# EAGLE schematic p20-001 (EAGLE 9.6.2)
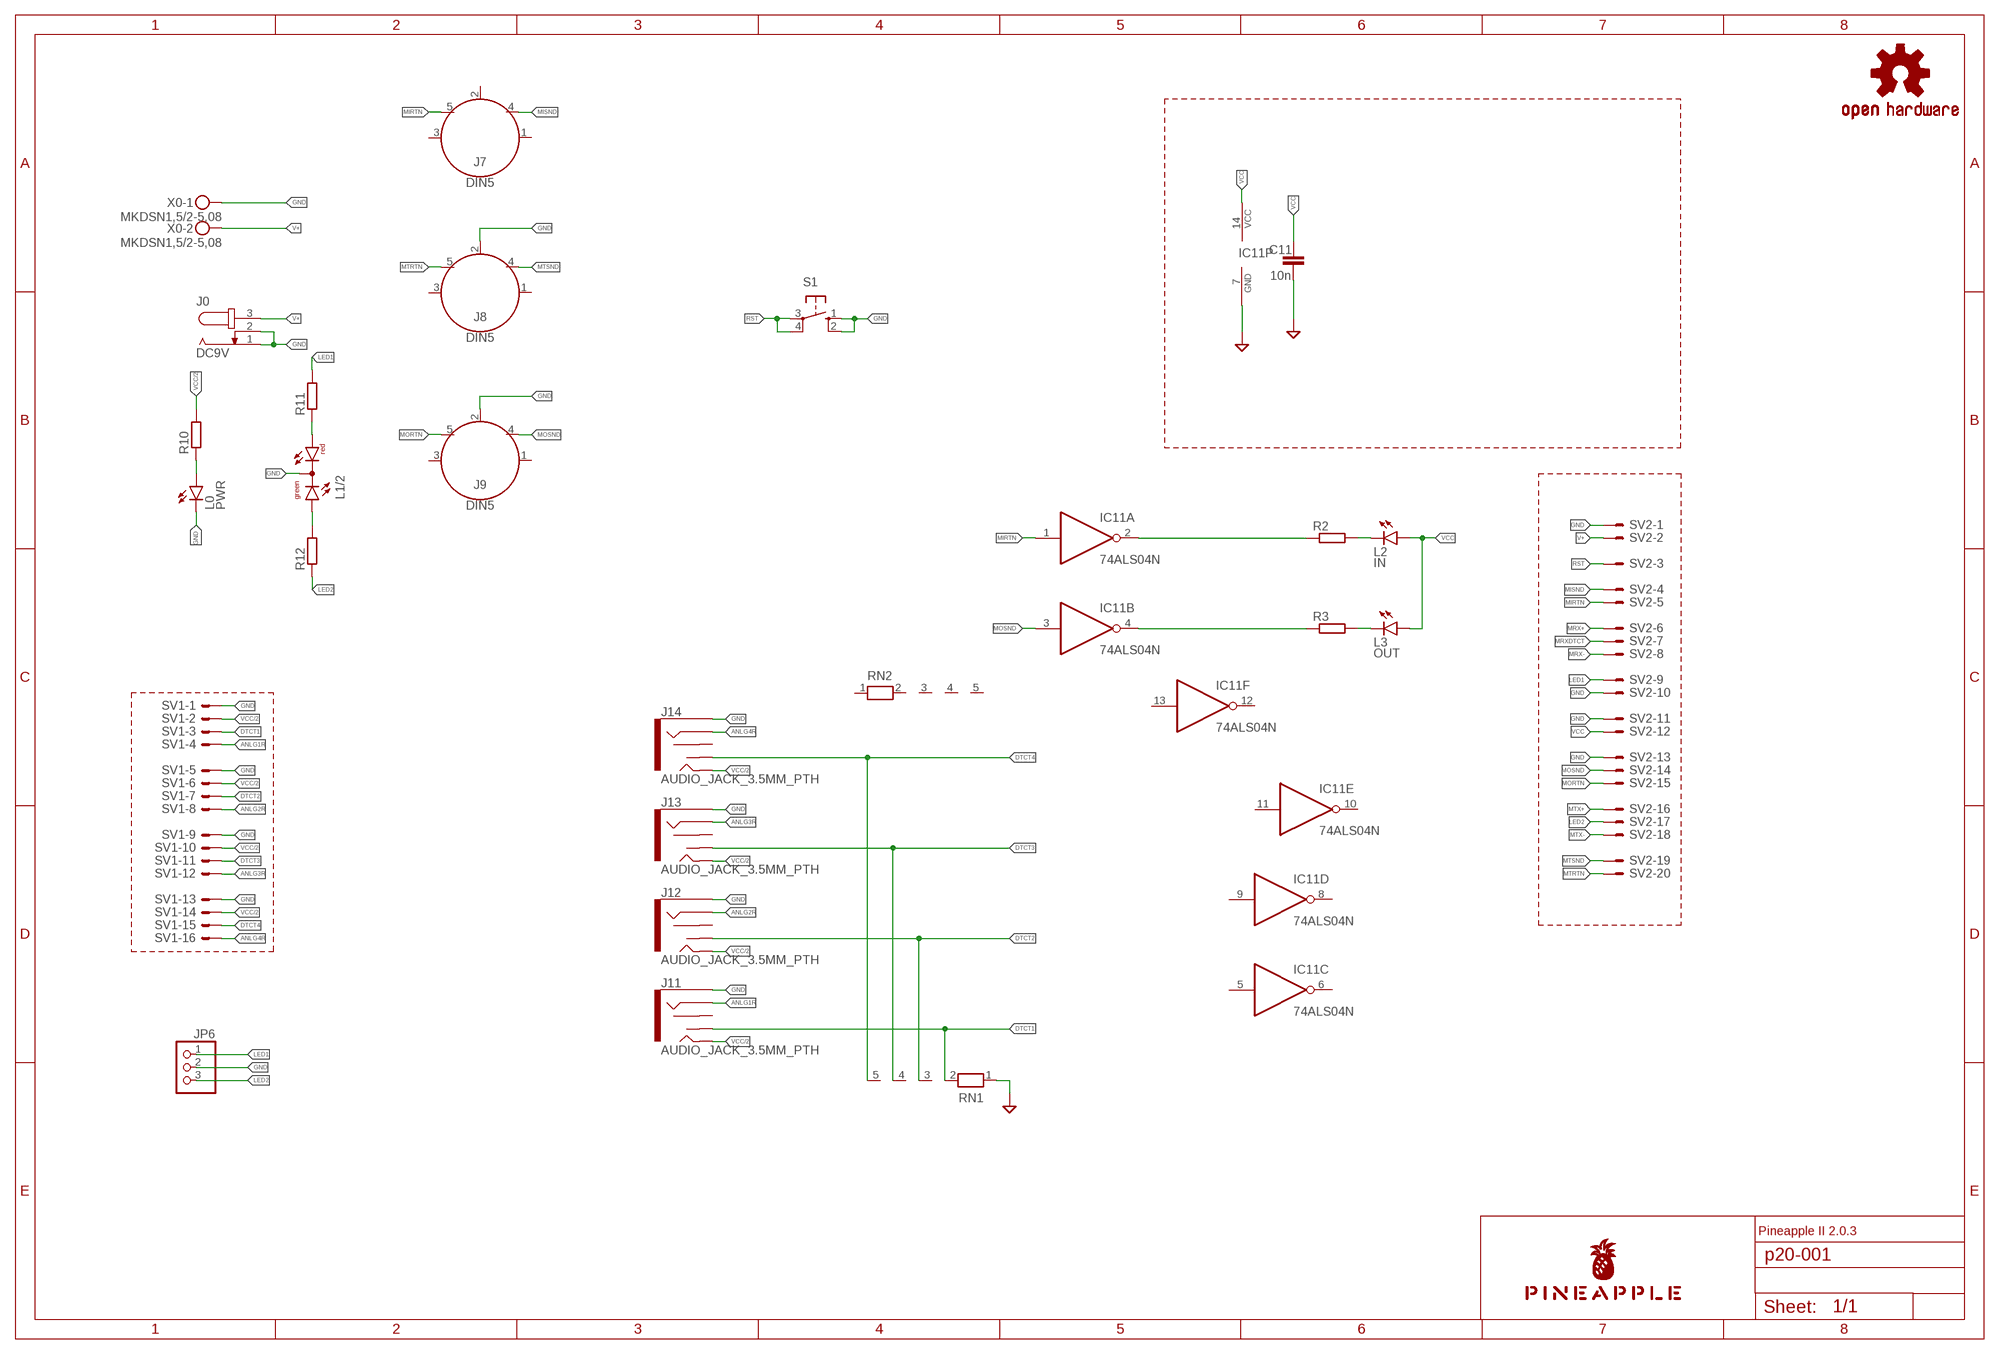
[diagram p0: schematic, sheet 1]

## Parts
C11  10n  C-EU025-024X044  [C025-024X044]
IC11  74ALS04N  [DIL14]
J0  DC9V  JACK-PLUG0  [SPC4077]
J7  DIN5  [DIN5-RA-PTH]
J8  DIN5  [DIN5-RA-PTH]
J9  DIN5  [DIN5-RA-PTH]
J11  AUDIO_JACK_3.5MM_PTH  [AUDIO-JACK]
J12  AUDIO_JACK_3.5MM_PTH  [AUDIO-JACK]
J13  AUDIO_JACK_3.5MM_PTH  [AUDIO-JACK]
J14  AUDIO_JACK_3.5MM_PTH  [AUDIO-JACK]
JP6  PINHD-1X3  [1X03]
L0  PWR  LED3MM  [LED3MM]
L1/2  DUOLED-RG-C  [DUOLED-C-5MM]
L2  IN  LED3MM  [LED3MM]
L3  OUT  LED3MM  [LED3MM]
LOGO1  OSHW-LOGOS-COPPER  [OSHW-LOGO-S_COPPER]
R2  R-EU_0204/5  [0204/5]
R3  R-EU_0204/5  [0204/5]
R10  R-EU_0204/5  [0204/5]
R11  R-EU_0204/5  [0204/5]
R12  R-EU_0204/5  [0204/5]
RN1  RN04  [RN-5]
RN2  RN04  [RN-5]
S1  10-XX  [B3F-10XX]
SV1  ML16LE  [ML16L]
SV2  ML20LE  [ML20L]
U$1  PINEAPPLE450_SILK  [PINEAPPLE450_SILK]
X0  MKDSN1,5/2-5,08  [MKDSN1,5/2-5,08]

## Nets
ANLG1R: J11.RING SV1.4
ANLG2R: J12.RING SV1.8
ANLG3R: J13.RING SV1.12
ANLG4R: J14.RING SV1.16
DTCT1: J11.TSH RN1.2 SV1.3
DTCT2: J12.TSH RN1.3 SV1.7
DTCT3: J13.TSH RN1.4 SV1.11
DTCT4: J14.TSH RN1.5 SV1.15
GND [gnd]: C11.2 IC11.7(P:GND) J0.1 J0.2 J8.2 J9.2 J11.SLEEVE J12.SLEEVE J13.SLEEVE J14.SLEEVE JP6.2 L0.K(C) L1/2.C RN1.1 S1.1(S) S1.2(S1) SV1.1 SV1.5 SV1.9 SV1.13 SV2.1 SV2.10 SV2.11 SV2.13 X0.1
LED1: JP6.1 R11.2 SV2.9
LED2: JP6.3 R12.1 SV2.17
LEDMI: L2.K(C) R2.2
LEDMO: L3.K(C) R3.2
LEDPWR: L0.A R10.1
MIRTN: IC11.1(A:I) J7.5 SV2.5
MISND: J7.4 SV2.4
MORTN: J9.5 SV2.15
MOSND: IC11.3(B:I) J9.4 SV2.14
MRX+: SV2.6
MRX-: SV2.8
MRXDTCT: SV2.7
MTRTN: J8.5 SV2.20
MTSND: J8.4 SV2.19
MTX+ [gnd]: SV2.16
MTX-: SV2.18
N$1: IC11.2(A:O) R2.1
N$2: IC11.4(B:O) R3.1
N$3: L1/2.AR R11.1
N$5: L1/2.AX(AG) R12.2
RST: S1.3(P) S1.4(P1) SV2.3
V+ [power]: J0.3 SV2.2 X0.2
VCC [power]: C11.1 IC11.14(P:VCC) L2.A L3.A SV2.12
VCC/2 [power]: J11.TIP J12.TIP J13.TIP J14.TIP R10.2 SV1.2 SV1.6 SV1.10 SV1.14
Unconnected: IC11.5(C:I) IC11.6(C:O) IC11.8(D:O) IC11.9(D:I) IC11.10(E:O) IC11.11(E:I) IC11.12(F:O) IC11.13(F:I) J7.1 J7.2 J7.3 J8.1 J8.3 J9.1 J9.3 J11.RSH J12.RSH J13.RSH J14.RSH RN2.1 RN2.2 RN2.3 RN2.4 RN2.5

## Notes on the sheet
- Pineapple II 2.0.3

## Library data of the parts
C11 = resistor:C-EU: CAPACITOR, European symbol
IC11 = 74xx-us:74*04: Hex INVERTER
J0 = con-jack:JACK-PLUG: DC POWER JACK Power Jack, DC, Right Angle, Through Hole, Rated 5A at 16VDC, PC Terminals Distributor: Farnell (www.Farnell.de) Drawing: 84N1161.pdf / 84N1162.pdf Manufacturer: SPC Technology (www.spctechnology.com) Type: SPC4077 / SPC 4078; OC_FARNELL: unknown; OC_NEWARK: unknown
J7-J9 = SparkFun-Connectors:DIN5: DIN5 Connector - Female Right Angle (frequently used as a MIDI Jack connector) This type of connector and cable is frequently used for transmitting midi data (musical instrument digital interface). It is what you usually see on a keyboard or set of electronic drums. Learn more here <https://en.wikipedia.org/wiki/MIDI>. For more information on the pinout and electrical specifications of MIDI communications, please see the following resource: https://www.midi.org/specifications/item/midi-din-electrical-specification Here is the connector we sell at SparkFun: MIDI Connector - Female Right Angle <https://www.sparkfun.com/products/9536> (PRT-09536) Datasheet <hhttp://www.sparkfun.com/datasheets/Prototyping/Connectors/MIDI-RA.pdf> It is used on this SparkFun product: SparkFun MIDI Shield <https://www.sparkfun.com/products/12898> (DEV-12898); PROD_ID: CONN-09481
J11-J14 = SparkFun-Connectors:AUDIO_JACK_3.5MM: Audio Jack 3.5mm variants of PTH and SMT stereo audio jack with bypass switches. SparkFun Products: SparkFun SparkPunk Sound Kit <[https://www.sparkfun.com/products/11177]> - PTH MP3 Trigger <https://www.sparkfun.com/products/13720> -3.5mm SMD SparkFun PicoBoard <https://www.sparkfun.com/products/11888>- 2.5mm SMD; PROD_ID: CONN-08774; SF_ID: PRT-08032
JP6 = pinhead:PINHD-1X3: PIN HEADER
L0 L2 L3 = led:LED: LED OSRAM: - CHIPLED LG R971, LG N971, LY N971, LG Q971, LY Q971, LO R971, LY R971 LH N974, LH R974 LS Q976, LO Q976, LY Q976 LO Q996 - Hyper CHIPLED LW Q18S LB Q993, LB Q99A, LB R99A - SideLED LS A670, LO A670, LY A670, LG A670, LP A670 LB A673, LV A673, LT A673, LW A673 LH A674 LY A675 LS A676, LA A676, LO A676, LY A676, LW A676 LS A679, LY A679, LG A679 - Hyper Micro SIDELED® LS Y876, LA Y876, LO Y876, LY Y876 LT Y87S - SmartLED LW L88C, LW L88S LB L89C, LB L89S, LG L890 LS L89K, LO L89K, LY L89K LS L896, LA L896, LO L896, LY L896 - TOPLED LS T670, LO T670, LY T670, LG T670, LP T670 LSG T670, LSP T670, LSY T670, LOP T670, LYG T670 LG T671, LOG T671, LSG T671 LB T673, LV T673, LT T673, LW T673 LH T674 LS T676, LA T676, LO T676, LY T676, LB T676, LH T676, LSB T676, LW T676 LB T67C, LV T67C, LT T67C, LS T67K, LO T67K, LY T67K, LW E67C LS E67B, LA E67B, LO E67B, LY E67B, LB E67C, LV E67C, LT E67C LW T67C LS T679, LY T679, LG T679 LS T770, LO T770, LY T770, LG T770, LP T770 LB T773, LV T773, LT T773, LW T773 LH T774 LS E675, LA E675, LY E675, LS T675 LS T776, LA T776, LO T776, LY T776, LB T776 LHGB T686 LT T68C, LB T68C - Hyper Mini TOPLED® LB M676 - Mini TOPLED Santana® LG M470 LS M47K, LO M47K, LY M47K Source: http://www.osram.convergy.de LUXEON: - LUMILED® LXK2-PW12-R00, LXK2-PW12-S00, LXK2-PW14-U00, LXK2-PW14-V00 LXK2-PM12-R00, LXK2-PM12-S00, LXK2-PM14-U00 LXK2-PE12-Q00, LXK2-PE12-R00, LXK2-PE12-S00, LXK2-PE14-T00, LXK2-PE14-U00 LXK2-PB12-K00, LXK2-PB12-L00, LXK2-PB12-M00, LXK2-PB14-N00, LXK2-PB14-P00, LXK2-PB14-Q00 LXK2-PR12-L00, LXK2-PR12-M00, LXK2-PR14-Q00, LXK2-PR14-R00 LXK2-PD12-Q00, LXK2-PD12-R00, LXK2-PD12-S00 LXK2-PH12-R00, LXK2-PH12-S00 LXK2-PL12-P00, LXK2-PL12-Q00, LXK2-PL12-R00 Source: www.luxeon.com KINGBRIGHT: KA-3528ASYC Source: www.kingbright.com
L1/2 = led:DUOLED-RG-C: DUO LED 2 colors (red/green), 5 mm, round, common Cathode www.ligitek.com or other producers.
LOGO1 = SparkFun-Aesthetics:OSHW-LOGO: Open-Source Hardware (OSHW) Logo This logo indicates the piece of hardware it is found on incorporates a OSHW license and/or adheres to the definition of open source hardware found here: http://freedomdefined.org/OSHW
R2 R3 R10-R12 = rcl:R-EU_: RESISTOR, European symbol; SPICEPREFIX: R
RN1 RN2 = resistor-net:RN04: RESISTOR NETWORK; OC_FARNELL: unknown; OC_NEWARK: unknown
S1 = switch-omron:10-XX: OMRON SWITCH; MPN: B3F-1000; OC_FARNELL: 176432; OC_NEWARK: 36M3542
SV1 = con-ml:ML16LE: HARTING; OC_FARNELL: unknown; OC_NEWARK: unknown
SV2 = con-ml:ML20LE: HARTING; OC_FARNELL: unknown; OC_NEWARK: unknown
U$1 = pineapple:PINEAPPLE450_SILK
X0 = con-phoenix-508:MKDSN1,5/2-5,08: MKDSN 1,5/ 2-5,08 Printklemme Nennstrom: 13,5 A Nennspannung: 250 V Rastermaß: 5,08 mm Polzahl: 2 Anschlussart: Schraubanschluss Montage: Löten Anschlussrichtung Leiter/Platine: 0 ° Artikelnummer: 1729128 Source: http://eshop.phoenixcontact.com .. 1729128.pdf

## Net classes
0 default: width 0.152 mm, drill 0.152 mm, clearance 0.152 mm
1 gnd: width 0.61 mm, drill 0.152 mm, clearance 0.152 mm
2 power: width 0.61 mm, drill 0.152 mm, clearance 0.152 mm
3 analog: width 0.305 mm, drill 0.152 mm, clearance 0.152 mm